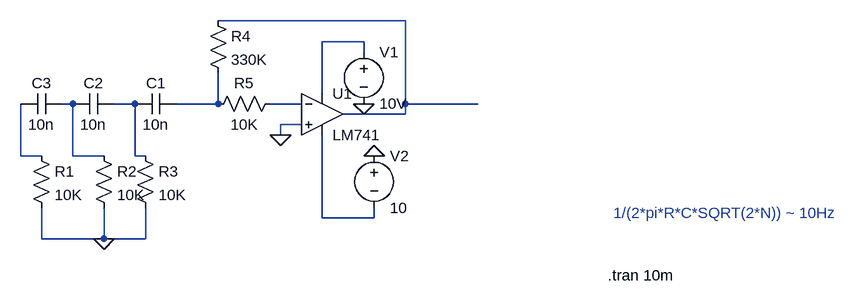
[diagram p0: schematic rc phase shift oscillators.asc]
rc phase shift oscillators.asc, the LTspice schematic file:
Version 4
SHEET 1 1192 680
WIRE 512 144 224 144
WIRE 448 176 384 176
WIRE 448 192 448 176
WIRE 384 256 384 176
WIRE 0 272 -16 272
WIRE 96 272 64 272
WIRE 224 272 224 224
WIRE 224 272 160 272
WIRE 352 272 304 272
WIRE 512 272 512 144
WIRE 624 272 512 272
WIRE 512 288 512 272
WIRE 512 288 416 288
WIRE 352 304 320 304
WIRE 320 320 320 304
WIRE -80 352 -80 272
WIRE -48 352 -80 352
WIRE 0 352 0 272
WIRE 48 352 0 352
WIRE 96 352 96 272
WIRE 112 352 96 352
WIRE 384 448 384 320
WIRE 464 448 464 432
WIRE 464 448 384 448
WIRE -48 480 -48 432
WIRE 48 480 48 432
WIRE 48 480 -48 480
WIRE 112 480 112 432
WIRE 112 480 48 480
FLAG 320 320 0
FLAG 448 272 0
FLAG 464 352 0
FLAG 48 480 0
SYMBOL LM741 384 224 R0
SYMATTR InstName U1
SYMBOL res -64 336 R0
SYMATTR InstName R1
SYMATTR Value 10K
SYMBOL res 32 336 R0
SYMATTR InstName R2
SYMATTR Value 10K
SYMBOL res 96 336 R0
SYMATTR InstName R3
SYMATTR Value 10K
SYMBOL res 208 128 R0
SYMATTR InstName R4
SYMATTR Value 330K
SYMBOL res 320 256 R90
WINDOW 0 0 56 VBottom 2
WINDOW 3 32 56 VTop 2
SYMATTR InstName R5
SYMATTR Value 10K
SYMBOL cap 160 256 R90
WINDOW 0 0 32 VBottom 2
WINDOW 3 32 32 VTop 2
SYMATTR InstName C1
SYMATTR Value 10n
SYMBOL cap 0 288 R270
WINDOW 0 32 32 VTop 2
WINDOW 3 0 32 VBottom 2
SYMATTR InstName C2
SYMATTR Value 10n
SYMBOL cap -16 256 R90
WINDOW 0 0 32 VBottom 2
WINDOW 3 32 32 VTop 2
SYMATTR InstName C3
SYMATTR Value 10n
SYMBOL voltage 448 176 R0
SYMATTR InstName V1
SYMATTR Value 10V
SYMBOL voltage 464 336 R0
SYMATTR InstName V2
SYMATTR Value 10
TEXT 832 440 Left 2 ;1/(2*pi*R*C*SQRT(2*N)) ~ 10Hz
TEXT 824 536 Left 2 !.tran 10m

The netlist it stands for:
* rc phase shift oscillators.asc
XU1 0 N006 N002 N008 N001 LM741  ; pins In+ In- V+ V- OUT
R1 N007 0 10K
R2 N003 0 10K
R3 N004 0 10K
R4 N001 N005 330K
R5 N006 N005 10K
C1 N005 N004 10n
C2 N003 N004 10n
C3 N003 N007 10n
V1 N002 0 10V
V2 0 N008 10
* 1/(2*pi*R*C*SQRT(2*N)) ~ 10Hz
.tran 10m
.lib LM741.lib
.backanno
.end